# Altium schematic sheet MCU.SchDoc
size A4; SheetNumber: 3; SheetTotal: 8
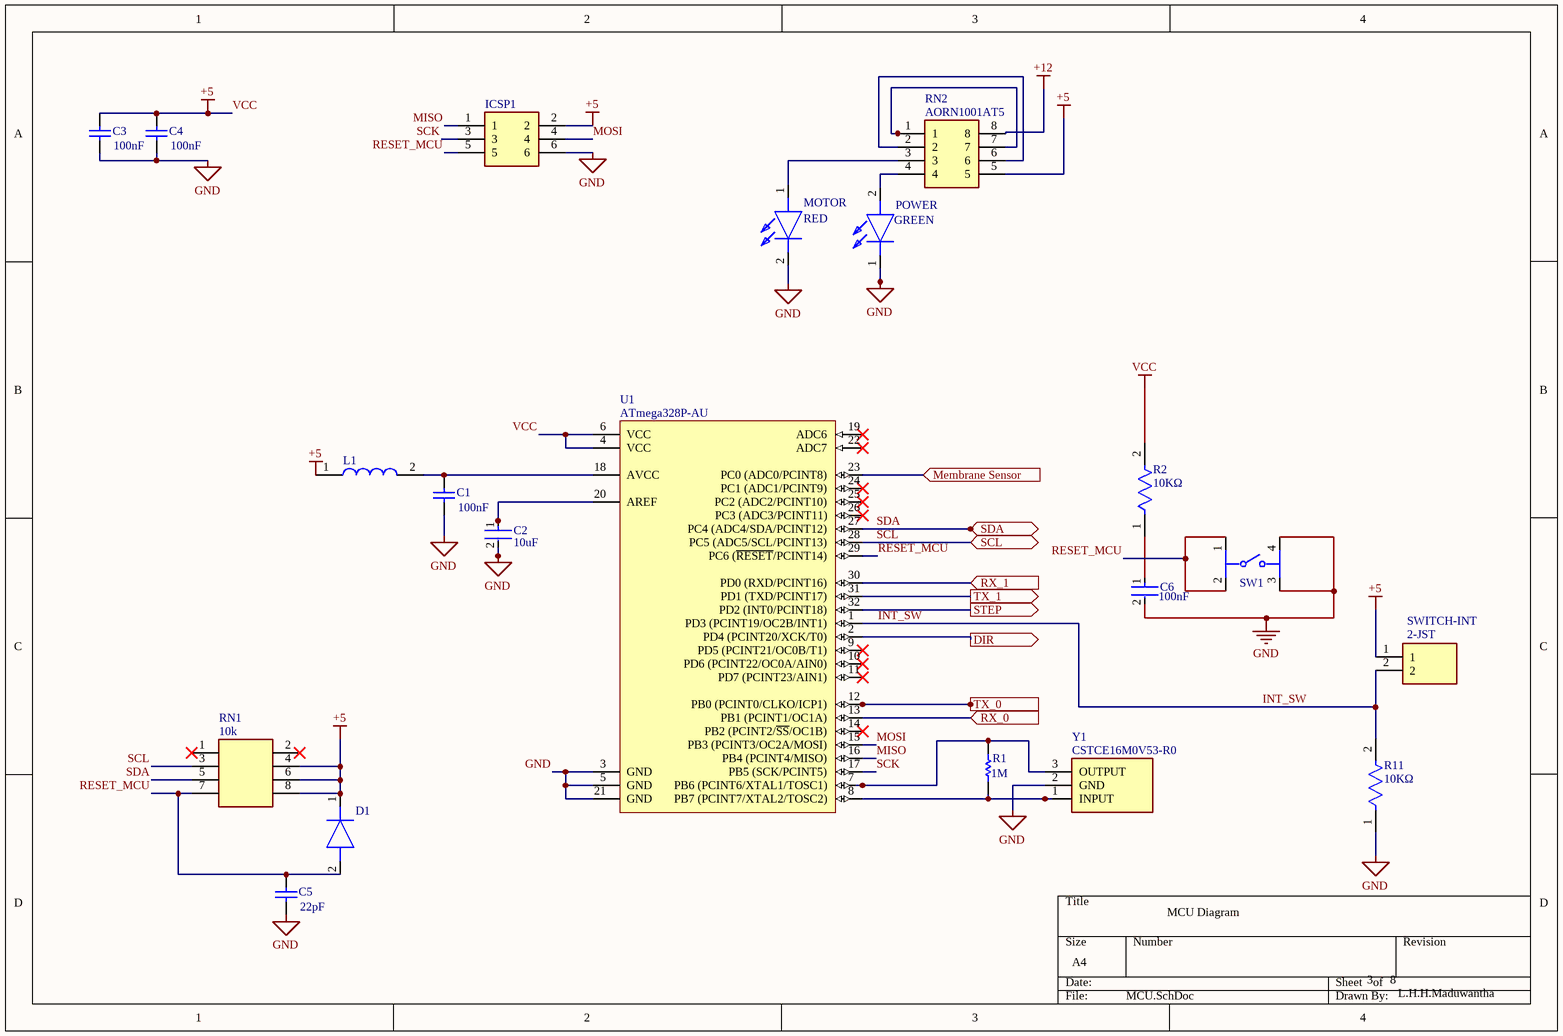
[diagram p0: MCU.SchDoc]

## Parts
C1  value 100nF  [CAPC1608X90X35LL15T15]  (hidden comment: 06035C104KAT4A)
C2  Capacitance: 10uF  [FP-CL31B106KBHNNNE-MFG]  (hidden comment: CL31B106KBHNNNE)
C3  value 100nF  [CAPC1608X90X35LL15T15]  (hidden comment: 06035C104KAT4A)
C4  value 100nF  [CAPC1608X90X35LL15T15]  (hidden comment: 06035C104KAT4A)
C5  value 22pF  [CAPC1608X90X35NL15T15]  (hidden comment: 06035A220JAT4A)
C6  Capacitance: 100nF  [FP-GRM31C-0_2-e0_3_0_8-IPC_B]  (hidden comment: GRM31C5C1H104JA01L)
D1  CD1206-S01575  [DIOC3215X95N]  (value not drawn)
ICSP1  PH2-06-UA  [HDRV6W64P254_2X3_762X500X901P]  (value not drawn)
L1  CV201210-100K  [INDC2012X145N]  (value not drawn)
MOTOR  COLOR: RED  [APT2012SECKJ3PRV]  (hidden comment: APT2012SECK_J3-PRV)
POWER  Color: GREEN  [LEDM2012X120N]  (hidden comment: KPT-2012SGC)
R1  value 1M  [RESC1608X55X30NL15T15]  (hidden comment: ERJ-3GEYJ105V)
R2  Resistance: 10KΩ  [FP-RT1206-MFG]  (hidden comment: RT1206BRD0710KL)
R11  Resistance: 10KΩ  [FP-RT1206-MFG]  (hidden comment: RT1206BRD0710KL)
RN1  value 10k  [CAY16-J4]  (hidden comment: CAY16-103J4GLF)
RN2  AORN1001AT5  [SOIC127P607X173-8N]
SW1  1571634-2  [FP-1571634-2-MFG]  (value not drawn)
SWITCH-INT  Name: 2-JST  [B2BXHAMLFSN]  (hidden comment: B2B-XH-AM_LF__SN_)
U1  ATmega328P-AU  [32A_M]
Y1  CSTCE16M0V53-R0  [CSTCE16M0V53R0]

## Ports
DIR (out, see Main[3A]), Membrane Sensor (in, see Main[2B], MembraneSensor[2C]), RX_0 (in, see Main[3B], UART_COM[2B]), RX_1 (in, see Main[3B], UART_COM[2C]), SCL (bidir, see Main[2C], PressureSensor[2C], UART_COM[2C]), SDA (bidir, see Main[2C], PressureSensor[2B], UART_COM[2C]), STEP (out, see Main[3A]), TX_0 (out, see Main[3B], UART_COM[2B]), TX_1 (out, see Main[3B], UART_COM[2B])

## Nets
+12: RN2.8
GND: C1.1 C2.2 C3.1 C4.1 C5.1 C6.2 ICSP1.6 MOTOR.2(K) POWER.1(K) R11.1 SW1.3 SW1.4 U1.3(GND) U1.5(GND) U1.21(GND) Y1.2(GND)
VCC: C3.2 C4.2 D1.1(K) ICSP1.2 L1.1 R2.2 RN1.4 RN1.6 RN1.8 RN2.5 SWITCH-INT.1 U1.4(VCC) U1.6(VCC)  [also labelled +5]
DIR: U1.2(PD4_(PCINT20/XCK/T0)) ; port DIR
INT_SW: R11.2 SWITCH-INT.2 U1.1(PD3_(PCINT19/OC2B/INT1))
Membrane Sensor: U1.23(PC0_(ADC0/PCINT8)) ; port Membrane Sensor
MISO: ICSP1.1 U1.16(PB4_(PCINT4/MISO))
MOSI: ICSP1.4 U1.15(PB3_(PCINT3/OC2A/MOSI))
RESET_MCU: C5.2 D1.2(A) ICSP1.5 RN1.7 SW1.1 SW1.2 U1.29(PC6_(~{RESET}/PCINT14))
RX_0: U1.13(PB1_(PCINT1/OC1A)) ; port RX_0
RX_1: U1.30(PD0_(RXD/PCINT16)) ; port RX_1
SCK: ICSP1.3 U1.17(PB5_(SCK/PCINT5))
SCL: RN1.3 U1.28(PC5_(ADC5/SCL/PCINT13)) ; port SCL
SDA: RN1.5 U1.27(PC4_(ADC4/SDA/PCINT12)) ; port SDA
STEP: U1.32(PD2_(INT0/PCINT18)) ; port STEP
TX_0: U1.12(PB0_(PCINT0/CLKO/ICP1)) ; port TX_0
TX_1: U1.31(PD1_(TXD/PCINT17)) ; port TX_1
NetC1_2: C1.2 L1.2 U1.18(AVCC)
NetC2_1: C2.1 U1.20(AREF)
NetC6_1: C6.1 R2.1
NetMOTOR_1: MOTOR.1(A) RN2.3
NetPOWER_2: POWER.2(A) RN2.4
NetR1_1: R1.1 U1.8(PB7_(PCINT7/XTAL2/TOSC2)) Y1.1(INPUT)
NetR1_2: R1.2 U1.7(PB6_(PCINT6/XTAL1/TOSC1)) Y1.3(OUTPUT)
NetRN2_1: RN2.1 RN2.7
NetRN2_2: RN2.2 RN2.6

Not connected (* = marked no-connect by the designer): RN1 1* 2*; U1 9(PD5_(PCINT21/OC0B/T1))* 10(PD6_(PCINT22/OC0A/AIN0))* 11(PD7_(PCINT23/AIN1))* 14(PB2_(PCINT2/~{SS}/OC1B))* 19(ADC6)* 22(ADC7)* 24(PC1_(ADC1/PCINT9))* 25(PC2_(ADC2/PCINT10))* 26(PC3_(ADC3/PCINT11))*

## Notes on the sheet
- MCU Diagram
- L.H.H.Maduwantha

## Library data of the parts
C1 C3 C4 = CMP-2006-04390-1: Manufacturer: AVX Interconnect / Elco; Part Number: 06035C104KAT4A
C2 = CMP-2000-07530-2: CAP CER 10UF 50V X7R 1206; Manufacturer: Samsung; Tolerance: 10%; Material: Ceramic; Temperature Coefficient: 15%; Temperature Characteristic: X7R; Digikey Description: CAP CER 10UF 50V X7R 1206; Device Class L1: Passive Components; Value: 10uF; Lead Free: Yes; Device Class L3: Ceramic Capacitors; Octopart: https://octopart.com/cl31b106kbhnnne-samsung-30507377; ComponentLink2URL: http://www.samsungsem.com/global/front/downloadcms.do?path=%2F%2Fglobal%2F%2Fsupport%2F%2Fproduct-search%2F%2Fmlcc%2F%2F__icsFiles%2F%2Fafieldfile%2F%2F2019%2F%2F06%2F%2F18&fileName=CL31B106KBHNNNE-19.pdf; Voltage Rating: 50V; Temperature Range Low: -55°C; RoHS: TRUE; Temperature: -55°C to +125°C; Category: Cap; ComponentLink2Description: Datasheet; Manufacturer Part Number: CL31B106KBHNNNE; Automotive: No; Device Class L2: Capacitors; Height: 1.8mm; Temperature Range High: +125°C; Package: CL31B106KBHNNNE
C5 = CMP-2006-04271-1: Manufacturer: AVX Interconnect / Elco; Part Number: 06035A220JAT4A
C6 = CMP-06035-003994-1: Chip Multilayer Ceramic Capacitors for General Purpose, 1206, 0.10uF, C0G, 30ppm/°C, 5%, 50V; Voltage: 50V; Package Quantity: 1; Min Operating Temperature: -55°C; Termination: SMD/SMT; Voltage Rating (DC): 50V; Thickness: 0.071inch; Max Operating Temperature: 125°C; Mount: Surface Mount; Height: 1.6mm; Weight: 0.000571oz; Length: 3.2mm; Case Code (Imperial): 1206; Tolerance: 5%; Lead Free: Lead Free; Material: Ceramic; REACH SVHC: No SVHC; Depth: 1.6mm; Case/Package: 1206; Radiation Hardening: No; Temperature Coefficient: 30ppm/°C; Packaging: Tape and Reel; Case Code (Metric): 3216; Dielectric: C0G; Width: 0.063inch; Voltage Rating: 50V
D1 = CD1206-S01575: Diode; Manufacturer_Name: Bourns; Datasheet Link: https://datasheet.datasheetarchive.com/originals/distributors/SFDatasheet-7/sf-000140098.pdf; Height: 0.95mm; Manufacturer_Part_Number: CD1206-S01575; Mouser Part Number: 652-CD1206-S01575; Mouser Price/Stock: https://www.mouser.co.uk/ProductDetail/Bourns/CD1206-S01575?qs=FITO%2F%2FQgYDlGQsqciGRLTg%3D%3D; Arrow Part Number: CD1206-S01575; Arrow Price/Stock: https://www.arrow.com/en/products/cd1206-s01575/bourns
ICSP1 = PH2-06-UA: Connector; Manufacturer_Name: Adam Tech; Datasheet Link: https://datasheet.datasheetarchive.com/originals/distributors/Datasheets_SAMA/c63e3fe101e7b6e3957e7ad4a1a98367.pdf; Height: 9.008mm; Manufacturer_Part_Number: PH2-06-UA; Arrow Part Number: PH2-06-UA; Arrow Price/Stock: https://www.arrow.com/en/products/ph2-06-ua/adam-tech?region=nac
L1 = CV201210-100K: Inductor; Manufacturer_Name: Bourns; Datasheet Link: https://www.bourns.com/docs/Product-Datasheets/CV201210.pdf; Height: 1.45mm; Manufacturer_Part_Number: CV201210-100K; Mouser Part Number: 652-CV201210-100K; Mouser Price/Stock: https://www.mouser.co.uk/ProductDetail/Bourns/CV201210-100K?qs=k2%252BVLg4AuuRLt64STpwovw%3D%3D; Arrow Part Number: CV201210-100K; Arrow Price/Stock: https://www.arrow.com/en/products/cv201210-100k/bourns?region=nac
MOTOR = APT2012SECK_J3-PRV: LED; Manufacturer_Name: Kingbright; Manufacturer_Part_Number: APT2012SECK/J3-PRV; Datasheet Link: https://www.mouser.de/datasheet/2/216/APT2012SECK-J3-PRV-1173389.pdf; Height: 0.85mm; Mouser Part Number: 604-APT2012SECKJ3PRV; Mouser Price/Stock: https://www.mouser.co.uk/ProductDetail/Kingbright/APT2012SECK-J3-PRV?qs=D2TOvUWgdJ6T9J6WfI%252BQOg%3D%3D; Arrow Part Number: APT2012SECK/J3-PRV; Arrow Price/Stock: https://www.arrow.com/en/products/apt2012seckj3-prv/kingbright?region=nac
POWER = KPT-2012SGC: LED; Manufacturer_Name: Kingbright; Datasheet Link: https://componentsearchengine.com/Datasheets/2/KPT-2012SGC.pdf; Height: 1.2mm; Manufacturer_Part_Number: KPT-2012SGC; Mouser Part Number: N/A; Mouser Price/Stock: https://www.mouser.co.uk/ProductDetail/Kingbright/KPT-2012SGC?qs=2JU0tDl2GZ3Evsz5LVxRxw%3D%3D; Arrow Part Number: KPT-2012SGC; Arrow Price/Stock: https://www.arrow.com/en/products/kpt-2012sgc/kingbright?region=europe
R1 = CMP-2000-00706-1: Manufacturer: Panasonic; Part Number: ERJ-3GEYJ105V
R2 R11 = CMP-2003-04273-2: RES 10.0K OHM 1/4W .1% SMD 1206; Manufacturer: Yageo; Power Rating: 0.25W; Temperature Coefficient: 25 ppm/°C; Voltage Rating: 200V; Value: 10KΩ; Tolerance: 0.005; ComponentLink2URL: http://www.yageo.com/documents/recent/PYu-RT_1-to-0.01_RoHS_L_9.pdf; ComponentLink2Description: Datasheet; Series: RT; Octopart: https://octopart.com/rt1206brd0710kl-yageo-1397513; Footprint Url: http://www.yageo.com/exep/pages/download/literatures/PYu-R_Mount_10.pdf; Manufacturer Part Number: RT1206BRD0710KL; Temperature: -55°C to +155°C; Digikey Description: RES 10.0K OHM 1/4W .1% SMD 1206; Ipc Land Pattern Name: RESC310160X55; Temperature Range Low: -55°C; Mouser Description: High Precision-High Stability Chip Resistor Thin Film 1206 10kOhm 0.1% Paper T/R; Composition: Thin Film; Category: Res; Temperature Range High: +155°C; Device Class L1: Passive Components; Height: 0.65mm; Package: RT1206; Lead Free: Yes; RoHS: TRUE; Device Class L2: Resistors; Device Class L3: Chip SMD Resistors; Automotive: No
RN1 = CAY16-103J4GLF: Resistor Network; Manufacturer_Name: Bourns; Datasheet Link: http://www.bourns.com/docs/Product-Datasheets/CATCAY.pdf; Manufacturer_Part_Number: CAY16-103J4GLF; Mouser Part Number: 652-CAY16-103J4GLF; Mouser Price/Stock: https://www.mouser.co.uk/ProductDetail/Bourns/CAY16-103J4GLF?qs=ehdiChDUEdVKSWacpiiZig%3D%3D; Arrow Part Number: CAY16-103J4GLF; Arrow Price/Stock: https://www.arrow.com/en/products/cay16-103j4glf/bourns
RN2 = AORN1001AT5: Resistor Network; Manufacturer_Name: Vishay; Datasheet Link: https://www.vishay.com/docs/60127/aorn.pdf; Height: 1.73mm; Manufacturer_Part_Number: AORN1001AT5; Mouser Part Number: 71-AORN1001AT5; Mouser Price/Stock: https://www.mouser.co.uk/ProductDetail/Vishay-Thin-Film/AORN1001AT5?qs=%252BSAr7%2F7Y%2FDjyCR3gKJzY4A%3D%3D
SW1 = CMP-03407-000008-1: SWITCH TACTILE SPST-NO 0.05A 24V; Actuator Length: 0.094inch; Max Current Rating: 50mA; Voltage Rating (DC): 12V; Actuator Material: Rubber; Switch Function: Off-Mom; Mechanical Life: 5000000Cycles; Actuator Type: Standard; Actuator Color: Natural; Illumination Type: Illuminated; Operating Force: 160gf; Throw Configuration: SPST; Package Quantity: 1000; Max Operating Temperature: 85°C; Mount: Surface Mount; Contact Plating: Silver; Depth: 10mm; Min Operating Temperature: -40°C; Radiation Hardening: No; ELV: Compliant; Case/Package: SMD/SMT; Length: 6.2mm; Termination: Gull Wing; Type: Switch; RoHS Compliant: Yes; Current Rating: 50mA; Contact Current Rating: 50mA; Orientation: Straight; Packaging: Tape and Reel; Max Voltage Rating (DC): 12V; Lead Free: Lead Free; Contact Material: Stainless Steel
SWITCH-INT = B2B-XH-AM_LF__SN_: Connector; Manufacturer_Name: JST (JAPAN SOLDERLESS TERMINALS); Manufacturer_Part_Number: B2B-XH-AM(LF)(SN); Datasheet Link: https://www.jst-mfg.com/product/pdf/eng/eXH.pdf; Height: 7mm; Arrow Part Number: B2B-XH-AM(LF)(SN); Arrow Price/Stock: https://www.arrow.com/en/products/b2b-xh-am-lf-sn/jst-manufacturing?region=europe
U1 = CMP-0095-00269-2: 8-bit AVR Microcontroller, 32KB Flash, 1KB EEPROM, 2KB SRAM, 32-pin TQFP, Industrial Grade (-40°C to 85°C); PackageDescription: 32-Lead, 7x7x1.0 mm Body, 0.8mm Lead Pitch, Thin Profile Plastic Quad Flat Package (TQFP); DatasheetVersion: revD, May-2011; RevisionNote: DatasheetVersion & PackageVersion updated. URLs added.; ComponentLink1URL: http://www.atmel.com/; ComponentLink2Description: ATmega48A/48PA/88A/88PA/168A/168PA/328/328P Datasheet; Code_JEDEC: MS-026-ABA; ComponentLink1Description: Manufacturer URL; PackageReference: 32A; ComponentLink3Description: ATmega48A/48PA/88A/88PA/168A/168PA/328/328P Summary; ComponentLink2URL: http://www.atmel.com/dyn/resources/prod_documents/doc8271.pdf; PackageVersion: revC, Oct-2010; ComponentLink3URL: http://www.atmel.com/dyn/resources/prod_documents/8271S.pdf
Y1 = CSTCE16M0V53-R0: Crystal or Oscillator; Manufacturer_Name: Murata Electronics; Value: 16MHz; Datasheet Link: https://www.murata.com/en-sg/products/productdetail?partno=CSTCE16M0V53-R0; Height: 1mm; Manufacturer_Part_Number: CSTCE16M0V53-R0; Mouser Part Number: 81-CSTCE16M0V53-R0; Mouser Price/Stock: https://www.mouser.co.uk/ProductDetail/Murata-Electronics/CSTCE16M0V53-R0?qs=HPA2Xx%252BU0WhPWbRcNuzhZw%3D%3D